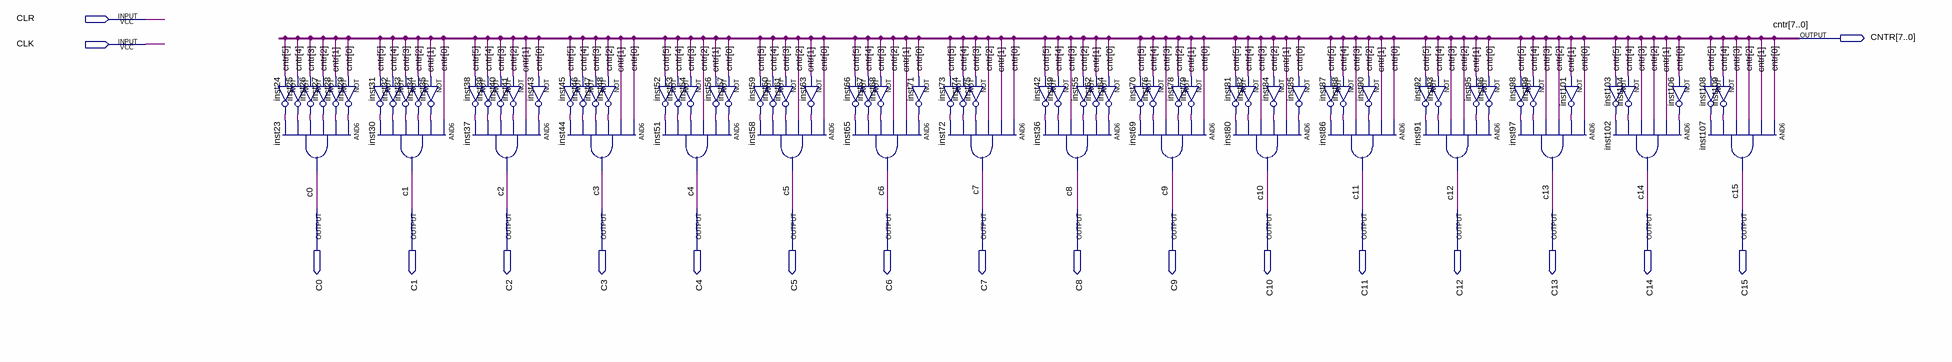
[diagram p0: schematic sheet]
// Quartus schematic CacheCounter.bdf as structural Verilog: 80 symbols, 19 pins
module CacheCounter (
  input  CLR,
  input  CLK,
  output [7:0] CNTR,
  output C0,
  output C1,
  output C2,
  output C3,
  output C4,
  output C5,
  output C6,
  output C7,
  output C8,
  output C9,
  output C10,
  output C11,
  output C12,
  output C13,
  output C14,
  output C15
);

  wire inst24_out, inst25_out, inst26_out, inst27_out, inst28_out, inst29_out, inst31_out, inst32_out,
       inst33_out, inst34_out, inst35_out, inst38_out, inst39_out, inst40_out, inst41_out, inst42_out,
       inst43_out, inst45_out, inst46_out, inst47_out, inst48_out, inst49_out, inst52_out, inst53_out,
       inst54_out, inst55_out, inst56_out, inst57_out, inst59_out, inst60_out, inst61_out, inst62_out,
       inst63_out, inst64_out, inst66_out, inst67_out, inst68_out, inst70_out, inst71_out, inst73_out,
       inst74_out, inst75_out, inst76_out, inst78_out, inst79_out, inst81_out, inst82_out, inst84_out,
       inst85_out, inst87_out, inst88_out, inst90_out, inst92_out, inst93_out, inst95_out, inst96_out,
       inst98_out, inst99_out, inst101_out, inst103_out, inst104_out, inst106_out, inst108_out, inst109_out;

  not inst24 (inst24_out, CNTR[5]);
  and inst23 (C0, inst29_out, inst28_out, inst27_out, inst26_out, inst25_out, inst24_out);
  not inst25 (inst25_out, CNTR[4]);
  not inst26 (inst26_out, CNTR[3]);
  not inst27 (inst27_out, CNTR[2]);
  not inst28 (inst28_out, CNTR[1]);
  not inst29 (inst29_out, CNTR[0]);
  not inst31 (inst31_out, CNTR[5]);
  and inst30 (C1, CNTR[0], inst35_out, inst34_out, inst33_out, inst32_out, inst31_out);
  not inst32 (inst32_out, CNTR[4]);
  not inst33 (inst33_out, CNTR[3]);
  not inst34 (inst34_out, CNTR[2]);
  not inst35 (inst35_out, CNTR[1]);
  not inst38 (inst38_out, CNTR[5]);
  not inst39 (inst39_out, CNTR[4]);
  and inst37 (C2, inst43_out, CNTR[1], inst41_out, inst40_out, inst39_out, inst38_out);
  not inst40 (inst40_out, CNTR[3]);
  not inst41 (inst41_out, CNTR[2]);
  not inst43 (inst43_out, CNTR[0]);
  not inst45 (inst45_out, CNTR[5]);
  not inst46 (inst46_out, CNTR[4]);
  and inst44 (C3, CNTR[0], CNTR[1], inst48_out, inst47_out, inst46_out, inst45_out);
  not inst47 (inst47_out, CNTR[3]);
  not inst48 (inst48_out, CNTR[2]);
  not inst52 (inst52_out, CNTR[5]);
  not inst53 (inst53_out, CNTR[4]);
  not inst54 (inst54_out, CNTR[3]);
  and inst51 (C4, inst57_out, inst56_out, CNTR[2], inst54_out, inst53_out, inst52_out);
  not inst56 (inst56_out, CNTR[1]);
  not inst57 (inst57_out, CNTR[0]);
  not inst59 (inst59_out, CNTR[5]);
  not inst60 (inst60_out, CNTR[4]);
  not inst61 (inst61_out, CNTR[3]);
  and inst58 (C5, CNTR[0], inst63_out, CNTR[2], inst61_out, inst60_out, inst59_out);
  not inst63 (inst63_out, CNTR[1]);
  not inst66 (inst66_out, CNTR[5]);
  not inst67 (inst67_out, CNTR[4]);
  not inst68 (inst68_out, CNTR[3]);
  and inst65 (C6, inst71_out, CNTR[1], CNTR[2], inst68_out, inst67_out, inst66_out);
  not inst71 (inst71_out, CNTR[0]);
  not inst73 (inst73_out, CNTR[5]);
  not inst74 (inst74_out, CNTR[4]);
  not inst75 (inst75_out, CNTR[3]);
  and inst72 (C7, CNTR[0], CNTR[1], CNTR[2], inst75_out, inst74_out, inst73_out);
  not inst42 (inst42_out, CNTR[5]);
  and inst36 (C8, inst64_out, inst62_out, inst55_out, CNTR[3], inst49_out, inst42_out);
  not inst49 (inst49_out, CNTR[4]);
  not inst55 (inst55_out, CNTR[2]);
  not inst62 (inst62_out, CNTR[1]);
  not inst64 (inst64_out, CNTR[0]);
  not inst70 (inst70_out, CNTR[5]);
  and inst69 (C9, CNTR[0], inst79_out, inst78_out, CNTR[3], inst76_out, inst70_out);
  not inst76 (inst76_out, CNTR[4]);
  not inst78 (inst78_out, CNTR[2]);
  not inst79 (inst79_out, CNTR[1]);
  not inst81 (inst81_out, CNTR[5]);
  not inst82 (inst82_out, CNTR[4]);
  and inst80 (C10, inst85_out, CNTR[1], inst84_out, CNTR[3], inst82_out, inst81_out);
  not inst84 (inst84_out, CNTR[2]);
  not inst85 (inst85_out, CNTR[0]);
  not inst87 (inst87_out, CNTR[5]);
  not inst88 (inst88_out, CNTR[4]);
  and inst86 (C11, CNTR[0], CNTR[1], inst90_out, CNTR[3], inst88_out, inst87_out);
  not inst90 (inst90_out, CNTR[2]);
  not inst92 (inst92_out, CNTR[5]);
  not inst93 (inst93_out, CNTR[4]);
  and inst91 (C12, inst96_out, inst95_out, CNTR[2], CNTR[3], inst93_out, inst92_out);
  not inst95 (inst95_out, CNTR[1]);
  not inst96 (inst96_out, CNTR[0]);
  not inst98 (inst98_out, CNTR[5]);
  not inst99 (inst99_out, CNTR[4]);
  and inst97 (C13, CNTR[0], inst101_out, CNTR[2], CNTR[3], inst99_out, inst98_out);
  not inst101 (inst101_out, CNTR[1]);
  not inst103 (inst103_out, CNTR[5]);
  not inst104 (inst104_out, CNTR[4]);
  and inst102 (C14, inst106_out, CNTR[1], CNTR[2], CNTR[3], inst104_out, inst103_out);
  not inst106 (inst106_out, CNTR[0]);
  not inst108 (inst108_out, CNTR[5]);
  not inst109 (inst109_out, CNTR[4]);
  and inst107 (C15, CNTR[0], CNTR[1], CNTR[2], CNTR[3], inst109_out, inst108_out);
endmodule
